# EAGLE design bms3 (EAGLE 5.04)

## Sheet 1 of 2
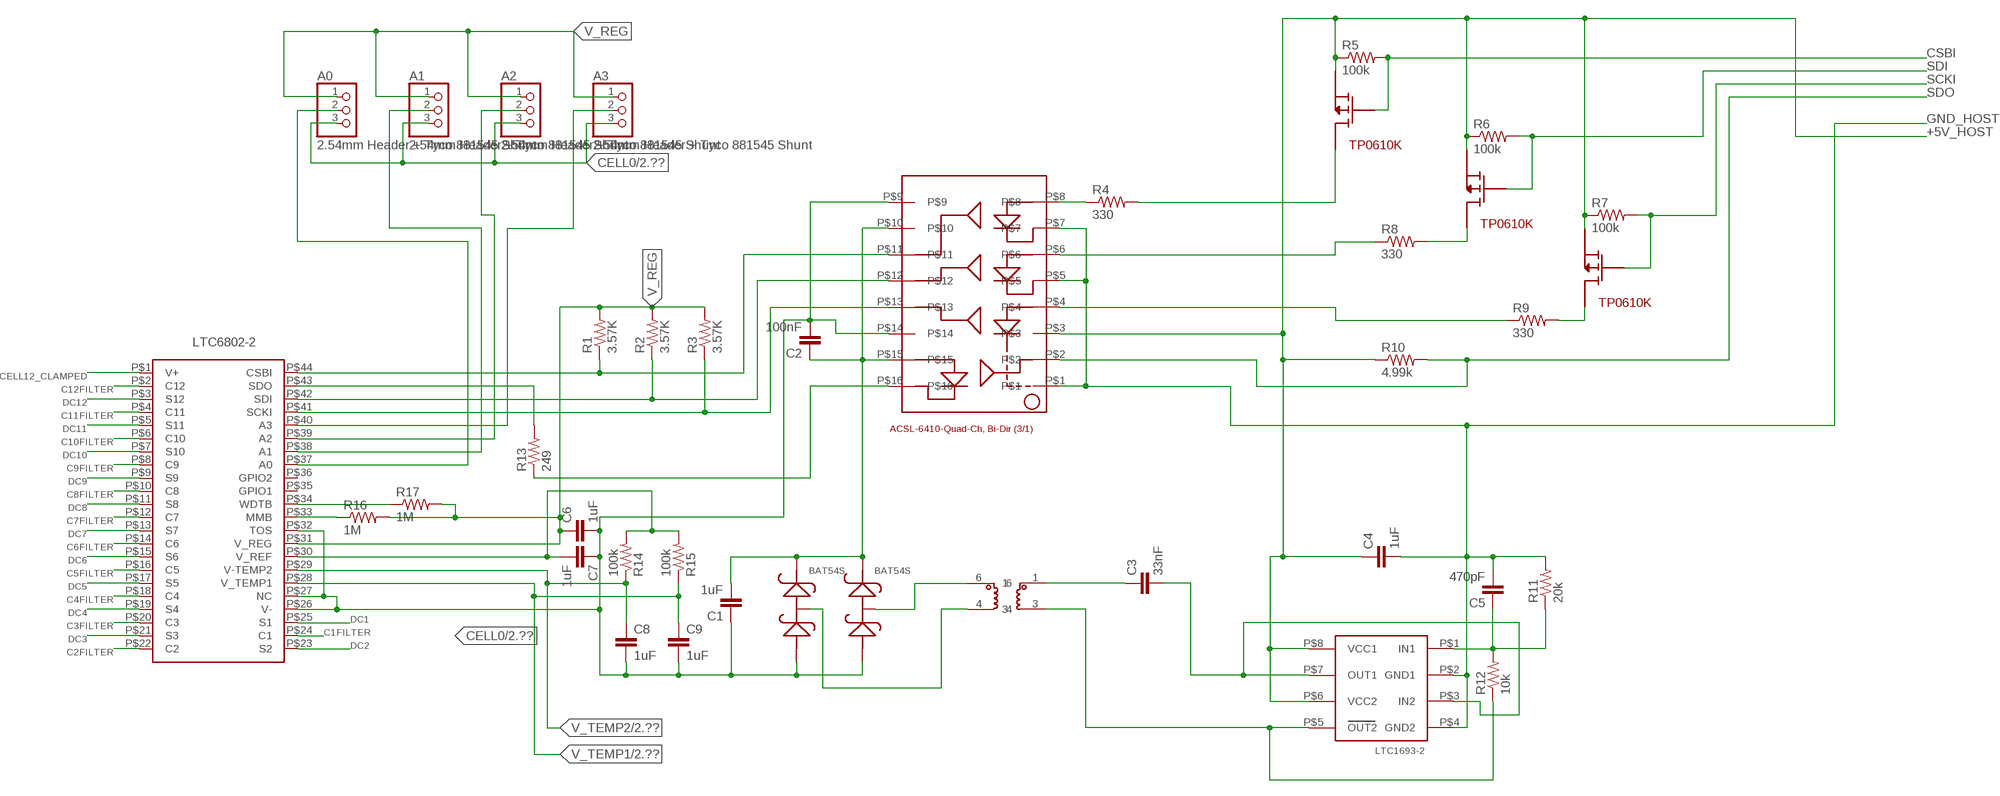
[diagram p0: schematic, sheet 1]

### Parts
A0  2.54mm Header + Tyco 881545 Shunt  PINHD-1X3  [1X03]
A1  2.54mm Header + Tyco 881545 Shunt  PINHD-1X3  [1X03]
A2  2.54mm Header + Tyco 881545 Shunt  PINHD-1X3  [1X03]
A3  2.54mm Header + Tyco 881545 Shunt  PINHD-1X3  [1X03]
ACSL6410  ACSL-6410  [ACSL-6410-SO16]
BAT1  BAT54S  [SOT-23]
BAT2  BAT54S  [SOT-23]
C1  1uF  C-EUC0402  [C0402]
C2  100nF  C-EUC0402  [C0402]
C3  33nF  C-EUC0402  [C0402]
C4  1uF  C-EUC0402  [C0402]
C5  470pF  C-EUC0402  [C0402]
C6  1uF  C-EUC0402  [C0402]
C7  1uF  C-EUC0402  [C0402]
C8  1uF  C-EUC0402  [C0402]
C9  1uF  C-EUC0402  [C0402]
CSBI  TP0610K  [SOT-23]
LTC1693  LTC1693-2  [S8-LTC1693-2]
LTC6802-2  LTC6802-2  [SSOP-44]
PE68386  PE68386  [PE68386]
R1  3.57K  R-US_R0402  [R0402]
R2  3.57K  R-US_R0402  [R0402]
R3  3.57K  R-US_R0402  [R0402]
R4  330  R-US_R0402  [R0402]
R5  100k  R-US_R0402  [R0402]
R6  100k  R-US_R0402  [R0402]
R7  100k  R-US_R0402  [R0402]
R8  330  R-US_R0402  [R0402]
R9  330  R-US_R0402  [R0402]
R10  4.99k  R-US_R0402  [R0402]
R11  20k  R-US_R0402  [R0402]
R12  10k  R-US_R0402  [R0402]
R13  249  R-US_R0402  [R0402]
R14  100k  R-US_R0402  [R0402]
R15  100k  R-US_R0402  [R0402]
R16  1M  R-US_R0402  [R0402]
R17  1M  R-US_R0402  [R0402]
SCKI  TP0610K  [SOT-23]
SDI  TP0610K  [SOT-23]

### Nets
+5V_HOST: ACSL6410.P$3 C4.1 CSBI.2 LTC1693.P$6(VCC2) LTC1693.P$8(VCC1) R5.1 R6.1 R7.1 R10.1 SCKI.2 SDI.2 ; also sheet 2
C1FILTER: LTC6802-2.P$24(C1) ; also sheet 2
C2FILTER: LTC6802-2.P$22(C2) ; also sheet 2
C3FILTER: LTC6802-2.P$20(C3) ; also sheet 2
C4FILTER: LTC6802-2.P$18(C4) ; also sheet 2
C5FILTER: LTC6802-2.P$16(C5) ; also sheet 2
C6FILTER: LTC6802-2.P$14(C6) ; also sheet 2
C7FILTER: LTC6802-2.P$12(C7) ; also sheet 2
C8FILTER: LTC6802-2.P$10(C8) ; also sheet 2
C9FILTER: LTC6802-2.P$8(C9) ; also sheet 2
C10FILTER: LTC6802-2.P$6(C10) ; also sheet 2
C11FILTER: LTC6802-2.P$4(C11) ; also sheet 2
C12FILTER: LTC6802-2.P$2(C12) ; also sheet 2
CELL0: A0.3 A1.3 A2.3 A3.3 ACSL6410.P$9 ACSL6410.P$14 BAT1.1 BAT2.1 C1.1 C2.2 C6.2 C7.1 C8.2 C9.2 LTC6802-2.P$26(V-) LTC6802-2.P$27(NC) LTC6802-2.P$32(TOS) ; also sheet 2
CELL12_CLAMPED: LTC6802-2.P$1(V+) ; also sheet 2
CSBI: CSBI.1 R5.2 ; also sheet 2
DC1: LTC6802-2.P$25(S1) ; also sheet 2
DC2: LTC6802-2.P$23(S2) ; also sheet 2
DC3: LTC6802-2.P$21(S3) ; also sheet 2
DC4: LTC6802-2.P$19(S4) ; also sheet 2
DC5: LTC6802-2.P$17(S5) ; also sheet 2
DC6: LTC6802-2.P$15(S6) ; also sheet 2
DC7: LTC6802-2.P$13(S7) ; also sheet 2
DC8: LTC6802-2.P$11(S8) ; also sheet 2
DC9: LTC6802-2.P$9(S9) ; also sheet 2
DC10: LTC6802-2.P$7(S10) ; also sheet 2
DC11: LTC6802-2.P$5(S11) ; also sheet 2
DC12: LTC6802-2.P$3(S12) ; also sheet 2
GND_HOST: ACSL6410.P$1 ACSL6410.P$5 ACSL6410.P$7 C4.2 C5.2 LTC1693.P$2(GND1) LTC1693.P$4(GND2) R11.2 ; also sheet 2
N$1: ACSL6410.P$11 LTC6802-2.P$44(CSBI) R1.1
N$2: A3.2 LTC6802-2.P$40(A3)
N$3: ACSL6410.P$12 LTC6802-2.P$42(SDI) R2.1
N$4: ACSL6410.P$13 LTC6802-2.P$41(SCKI) R3.1
N$5: A2.2 LTC6802-2.P$39(A2)
N$6: A1.2 LTC6802-2.P$38(A1)
N$7: ACSL6410.P$16 R13.1
N$8: LTC6802-2.P$43(SDO) R13.2
N$10: BAT2.3 PE68386.6
N$11: BAT1.3 PE68386.4
N$12: R8.2 SDI.3
N$13: C3.1 PE68386.1
N$14: LTC1693.P$5(OUT2) PE68386.3 R12.1
N$15: C3.2 LTC1693.P$3(IN2) LTC1693.P$7(OUT1)
N$16: A0.2 LTC6802-2.P$37(A0)
N$17: ACSL6410.P$6 R8.1
N$18: C5.1 LTC1693.P$1(IN1) R11.1 R12.2
N$19: R9.2 SCKI.3
N$20: ACSL6410.P$4 R9.1
N$22: LTC6802-2.P$34(WDTB) R17.1
N$24: LTC6802-2.P$33(MMB) R16.1
N$25: ACSL6410.P$8 R4.1
N$26: CSBI.3 R4.2
N$31: ACSL6410.P$10 ACSL6410.P$15 BAT1.2 BAT2.2 C1.2 C2.1
SCKI: R7.2 SCKI.1 ; also sheet 2
SDI: R6.2 SDI.1 ; also sheet 2
SDO: ACSL6410.P$2 R10.2 ; also sheet 2
V_REF: C7.2 LTC6802-2.P$30(V_REF) R14.2 R15.2
V_REG: A0.1 A1.1 A2.1 A3.1 C6.1 LTC6802-2.P$31(V_REG) R1.2 R2.2 R3.2 R16.2 R17.2
V_TEMP1: C9.1 LTC6802-2.P$28(V_TEMP1) R15.1 ; also sheet 2
V_TEMP2: C8.1 LTC6802-2.P$29(V-TEMP2) R14.1 ; also sheet 2
Unconnected: LTC6802-2.P$35(GPIO1) LTC6802-2.P$36(GPIO2)

## Sheet 2 of 2
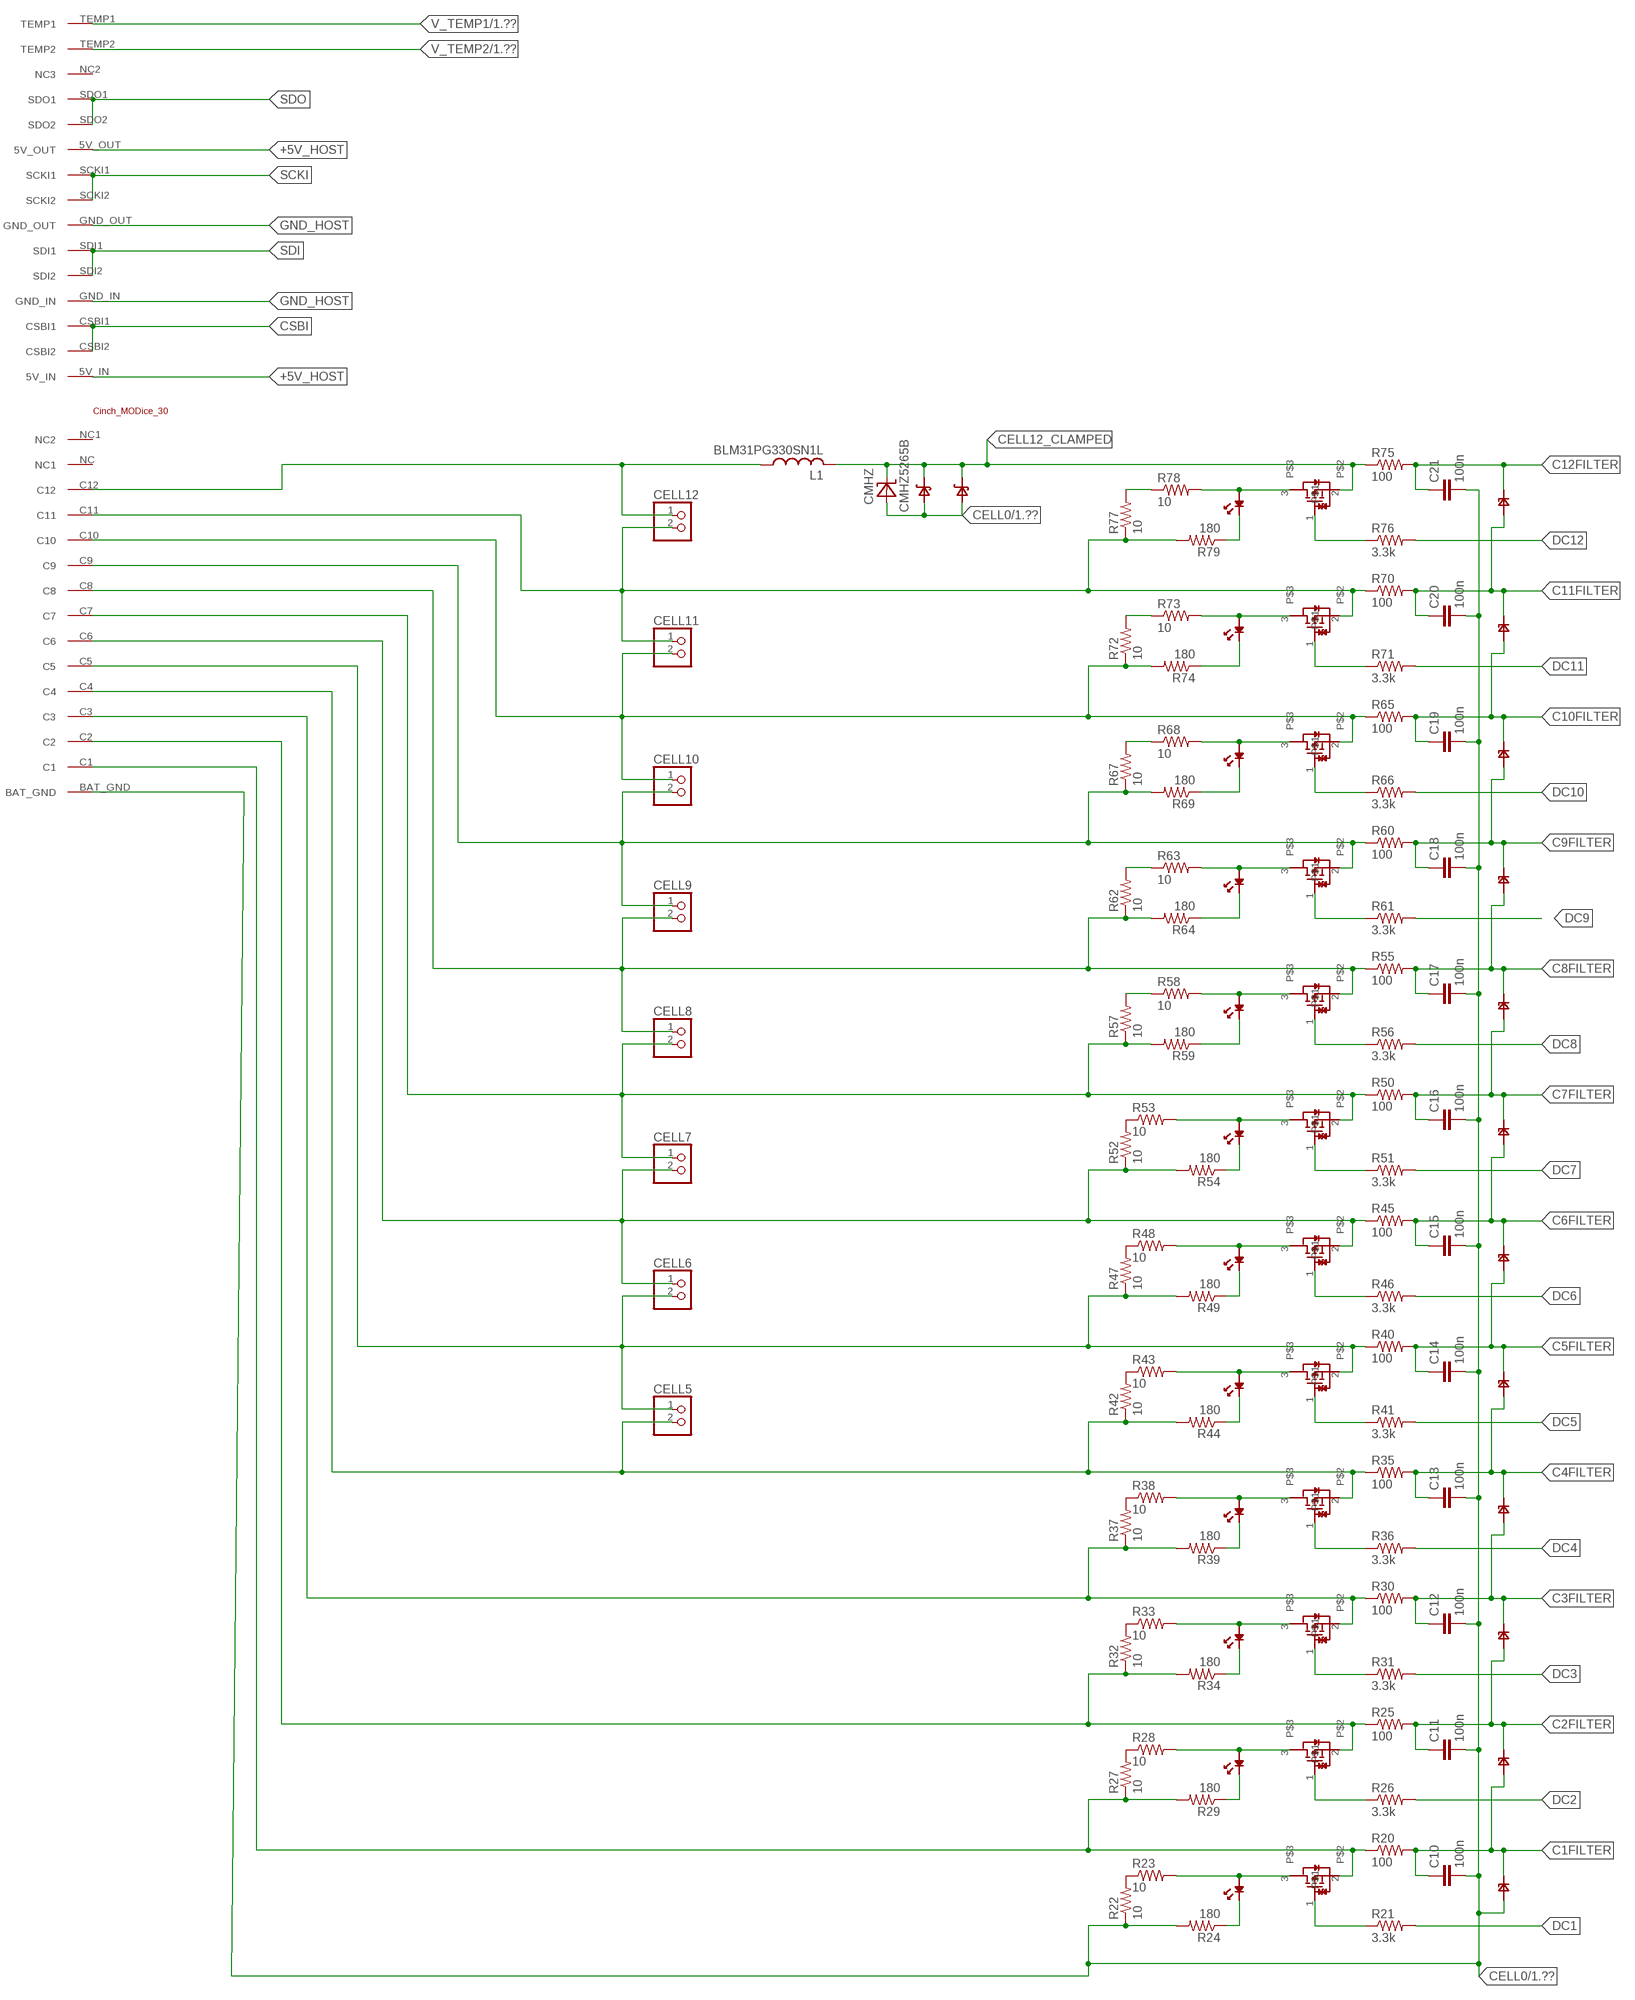
[diagram p1: schematic, sheet 2]

### Parts
BAT3  BAT46W  [SOD123]
BAT4  BAT46W  [SOD123]
C10  100n  C-EUC0402  [C0402]
C11  100n  C-EUC0402  [C0402]
C12  100n  C-EUC0402  [C0402]
C13  100n  C-EUC0402  [C0402]
C14  100n  C-EUC0402  [C0402]
C15  100n  C-EUC0402  [C0402]
C16  100n  C-EUC0402  [C0402]
C17  100n  C-EUC0402  [C0402]
C18  100n  C-EUC0402  [C0402]
C19  100n  C-EUC0402  [C0402]
C20  100n  C-EUC0402  [C0402]
C21  100n  C-EUC0402  [C0402]
CELL5  PINHD-1X2  [1X02]
CELL6  PINHD-1X2  [1X02]
CELL7  PINHD-1X2  [1X02]
CELL8  PINHD-1X2  [1X02]
CELL9  PINHD-1X2  [1X02]
CELL10  PINHD-1X2  [1X02]
CELL11  PINHD-1X2  [1X02]
CELL12  PINHD-1X2  [1X02]
CMHZ  CMHZ5265B  [SOD123]
L1  BLM31PG330SN1L  L-USL3216C  [L3216C]
LED1  LED-0805  [0805]
LED2  LED-0805  [0805]
LED3  LED-0805  [0805]
LED4  LED-0805  [0805]
LED5  LED-0805  [0805]
LED6  LED-0805  [0805]
LED7  LED-0805  [0805]
LED8  LED-0805  [0805]
LED9  LED-0805  [0805]
LED10  LED-0805  [0805]
LED11  LED-0805  [0805]
LED12  LED-0805  [0805]
MODICE  MODICE_30  [CINCH_HEADER30]
PD1  PDZ7.5B  [SOD323]
PD2  PDZ7.5B  [SOD323]
PD3  PDZ7.5B  [SOD323]
PD4  PDZ7.5B  [SOD323]
PD5  PDZ7.5B  [SOD323]
PD6  PDZ7.5B  [SOD323]
PD7  PDZ7.5B  [SOD323]
PD8  PDZ7.5B  [SOD323]
PD9  PDZ7.5B  [SOD323]
PD10  PDZ7.5B  [SOD323]
PD11  PDZ7.5B  [SOD323]
PD12  PDZ7.5B  [SOD323]
R20  100  R-US_R0402  [R0402]
R21  3.3k  R-US_R0402  [R0402]
R22  10  R-US_R2512  [R2512]
R23  10  R-US_R2512  [R2512]
R24  180  R-US_R0805  [R0805]
R25  100  R-US_R0402  [R0402]
R26  3.3k  R-US_R0402  [R0402]
R27  10  R-US_R2512  [R2512]
R28  10  R-US_R2512  [R2512]
R29  180  R-US_R0805  [R0805]
R30  100  R-US_R0402  [R0402]
R31  3.3k  R-US_R0402  [R0402]
R32  10  R-US_R2512  [R2512]
R33  10  R-US_R2512  [R2512]
R34  180  R-US_R0805  [R0805]
R35  100  R-US_R0402  [R0402]
R36  3.3k  R-US_R0402  [R0402]
R37  10  R-US_R2512  [R2512]
R38  10  R-US_R2512  [R2512]
R39  180  R-US_R0805  [R0805]
R40  100  R-US_R0402  [R0402]
R41  3.3k  R-US_R0402  [R0402]
R42  10  R-US_R2512  [R2512]
R43  10  R-US_R2512  [R2512]
R44  180  R-US_R0805  [R0805]
R45  100  R-US_R0402  [R0402]
R46  3.3k  R-US_R0402  [R0402]
R47  10  R-US_R2512  [R2512]
R48  10  R-US_R2512  [R2512]
R49  180  R-US_R0805  [R0805]
R50  100  R-US_R0402  [R0402]
R51  3.3k  R-US_R0402  [R0402]
R52  10  R-US_R2512  [R2512]
R53  10  R-US_R2512  [R2512]
R54  180  R-US_R0805  [R0805]
R55  100  R-US_R0402  [R0402]
R56  3.3k  R-US_R0402  [R0402]
R57  10  R-US_R2512  [R2512]
R58  10  R-US_R2512  [R2512]
R59  180  R-US_R0805  [R0805]
R60  100  R-US_R0402  [R0402]
R61  3.3k  R-US_R0402  [R0402]
R62  10  R-US_R2512  [R2512]
R63  10  R-US_R2512  [R2512]
R64  180  R-US_R0805  [R0805]
R65  100  R-US_R0402  [R0402]
R66  3.3k  R-US_R0402  [R0402]
R67  10  R-US_R2512  [R2512]
R68  10  R-US_R2512  [R2512]
R69  180  R-US_R0805  [R0805]
R70  100  R-US_R0402  [R0402]
R71  3.3k  R-US_R0402  [R0402]
R72  10  R-US_R2512  [R2512]
R73  10  R-US_R2512  [R2512]
R74  180  R-US_R0805  [R0805]
R75  100  R-US_R0402  [R0402]
R76  3.3k  R-US_R0402  [R0402]
R77  10  R-US_R2512  [R2512]
R78  10  R-US_R2512  [R2512]
R79  180  R-US_R0805  [R0805]
T1  RTR020P02  [TSMT3]
T2  RTR020P02  [TSMT3]
T3  RTR020P02  [TSMT3]
T4  RTR020P02  [TSMT3]
T5  RTR020P02  [TSMT3]
T6  RTR020P02  [TSMT3]
T7  RTR020P02  [TSMT3]
T8  RTR020P02  [TSMT3]
T9  RTR020P02  [TSMT3]
T10  RTR020P02  [TSMT3]
T11  RTR020P02  [TSMT3]
T12  RTR020P02  [TSMT3]

### Nets
+5V_HOST: MODICE.5V_IN MODICE.5V_OUT ; also sheet 1
C1FILTER: C10.1 PD1.P$1 PD2.P$2 R20.2 ; also sheet 1
C2FILTER: C11.1 PD2.P$1 PD3.P$2 R25.2 ; also sheet 1
C3FILTER: C12.1 PD3.P$1 PD4.P$2 R30.2 ; also sheet 1
C4FILTER: C13.1 PD4.P$1 PD5.P$2 R35.2 ; also sheet 1
C5FILTER: C14.1 PD5.P$1 PD6.P$2 R40.2 ; also sheet 1
C6FILTER: C15.1 PD6.P$1 PD7.P$2 R45.2 ; also sheet 1
C7FILTER: C16.1 PD7.P$1 PD8.P$2 R50.2 ; also sheet 1
C8FILTER: C17.1 PD8.P$1 PD9.P$2 R55.2 ; also sheet 1
C9FILTER: C18.1 PD9.P$1 PD10.P$2 R60.2 ; also sheet 1
C10FILTER: C19.1 PD10.P$1 PD11.P$2 R65.2 ; also sheet 1
C11FILTER: C20.1 PD11.P$1 PD12.P$2 R70.2 ; also sheet 1
C12FILTER: C21.1 PD12.P$1 R75.2 ; also sheet 1
CELL0: BAT3.POS BAT4.POS C10.2 C11.2 C12.2 C13.2 C14.2 C15.2 C16.2 C17.2 C18.2 C19.2 C20.2 C21.2 CMHZ.POS(A) MODICE.BAT_GND PD1.P$2 R22.1 R24.2 ; also sheet 1
CELL1: MODICE.C1 R20.1 R27.1 R29.2 T1.2
CELL2: MODICE.C2 R25.1 R32.1 R34.2 T2.2
CELL3: MODICE.C3 R30.1 R37.1 R39.2 T3.2
CELL4: CELL5.2 MODICE.C4 R35.1 R42.1 R44.2 T4.2
CELL5: CELL5.1 CELL6.2 MODICE.C5 R40.1 R47.1 R49.2 T5.2
CELL6: CELL6.1 CELL7.2 MODICE.C6 R45.1 R52.1 R54.2 T6.2
CELL7: CELL7.1 CELL8.2 MODICE.C7 R50.1 R57.1 R59.2 T7.2
CELL8: CELL8.1 CELL9.2 MODICE.C8 R55.1 R62.1 R64.2 T8.2
CELL9: CELL9.1 CELL10.2 MODICE.C9 R60.1 R67.1 R69.2 T9.2
CELL10: CELL10.1 CELL11.2 MODICE.C10 R65.1 R72.1 R74.2 T10.2
CELL11: CELL11.1 CELL12.2 MODICE.C11 R70.1 R77.1 R79.2 T11.2
CELL12: CELL12.1 L1.1 MODICE.C12
CELL12_CLAMPED: BAT3.NEG BAT4.NEG CMHZ.NEG(C) L1.2 R75.1 T12.2 ; also sheet 1
CSBI: MODICE.CSBI1 MODICE.CSBI2 ; also sheet 1
DC1: R21.2 ; also sheet 1
DC2: R26.2 ; also sheet 1
DC3: R31.2 ; also sheet 1
DC4: R36.2 ; also sheet 1
DC5: R41.2 ; also sheet 1
DC6: R46.2 ; also sheet 1
DC7: R51.2 ; also sheet 1
DC8: R56.2 ; also sheet 1
DC9: R61.2 ; also sheet 1
DC10: R66.2 ; also sheet 1
DC11: R71.2 ; also sheet 1
DC12: R76.2 ; also sheet 1
GND_HOST: MODICE.GND_IN MODICE.GND_OUT ; also sheet 1
LED3: LED3.P$1 R34.1
N$9: R77.2 R78.1
N$27: LED1.P$2 R23.2 T1.3
N$28: LED1.P$1 R24.1
N$29: LED2.P$2 R28.2 T2.3
N$30: R21.1 T1.1
N$32: R72.2 R73.1
N$33: R67.2 R68.1
N$34: LED2.P$1 R29.1
N$35: R26.1 T2.1
N$36: R62.2 R63.1
N$37: LED9.P$2 R63.2 T9.3
N$38: R57.2 R58.1
N$39: LED3.P$2 R33.2 T3.3
N$40: R52.2 R53.1
N$41: R31.1 T3.1
N$42: R47.2 R48.1
N$43: LED4.P$2 R38.2 T4.3
N$44: LED4.P$1 R39.1
N$45: R42.2 R43.1
N$46: R37.2 R38.1
N$47: LED9.P$1 R64.1
N$48: R32.2 R33.1
N$49: LED5.P$2 R43.2 T5.3
N$50: LED5.P$1 R44.1
N$51: R41.1 T5.1
N$52: R27.2 R28.1
N$53: LED6.P$2 R48.2 T6.3
N$54: LED6.P$1 R49.1
N$55: R46.1 T6.1
N$56: R22.2 R23.1
N$57: R61.1 T9.1
N$59: LED7.P$2 R53.2 T7.3
N$60: LED7.P$1 R54.1
N$61: R51.1 T7.1
N$63: LED8.P$2 R58.2 T8.3
N$64: LED8.P$1 R59.1
N$65: R56.1 T8.1
N$72: LED10.P$2 R68.2 T10.3
N$73: LED10.P$1 R69.1
N$74: R66.1 T10.1
N$77: LED11.P$2 R73.2 T11.3
N$78: LED11.P$1 R74.1
N$79: R71.1 T11.1
N$81: LED12.P$2 R78.2 T12.3
N$82: LED12.P$1 R79.1
N$83: R76.1 T12.1
SCKI: MODICE.SCKI1 MODICE.SCKI2 ; also sheet 1
SDI: MODICE.SDI1 MODICE.SDI2 ; also sheet 1
SDO: MODICE.SDO1 MODICE.SDO2 ; also sheet 1
T4: R36.1 T4.1
V_TEMP1: MODICE.TEMP1 ; also sheet 1
V_TEMP2: MODICE.TEMP2 ; also sheet 1
Unconnected: MODICE.NC1(NC2) MODICE.NC2(NC3) MODICE.NC(NC1)

## Library data of the parts
A0 A1-A3 = pinhead:PINHD-1X3: PIN HEADER
ACSL6410 = BMS:ACSL-6410
BAT1 BAT2 = BMS:BAT54S
BAT3 BAT4 = BMS:BAT46W: BAT46W Small singla Schottky Diode
C1-C21 = rcl:C-EU: CAPACITOR, European symbol
CELL5-CELL12 = pinhead:PINHD-1X2: PIN HEADER
CMHZ = BMS:CMHZ5265B
CSBI SCKI SDI = BMS:TP0610K
L1 = rcl:L-US: INDUCTOR, American symbol
LED1-LED12 = BMS:LED-0805: Green 2V 20mA SMT diode
LTC1693 = BMS:LTC1693-2
LTC6802-2 = BMS:LTC6802-2
MODICE = BMS:MODICE_30: Cinch MODice 30 enclosure header
PD1-PD12 = BMS:PDZ7.5B
PE68386 = BMS:PE68386
R1-R17 R20-R79 = rcl:R-US_: RESISTOR, American symbol
T1-T12 = BMS:RTR020P02

## Board
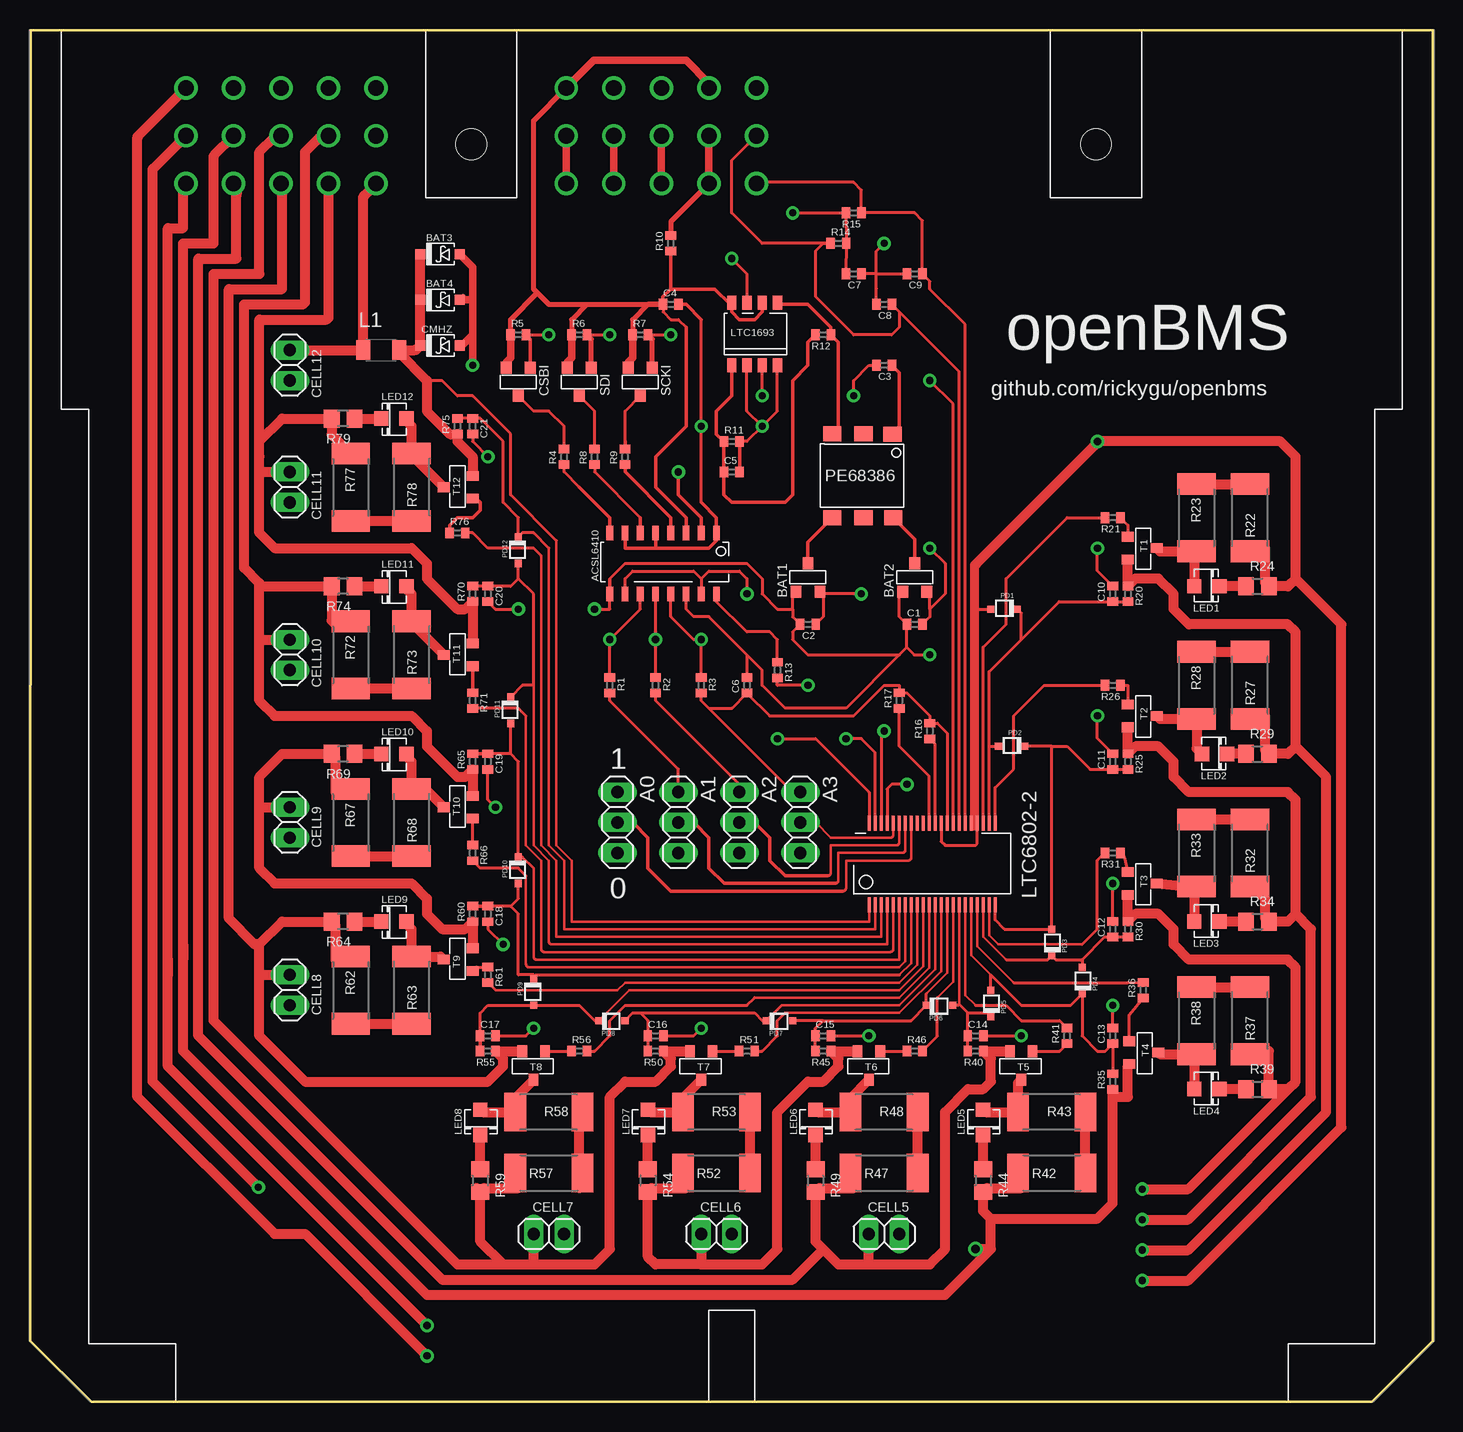
[diagram p2: board, top side]
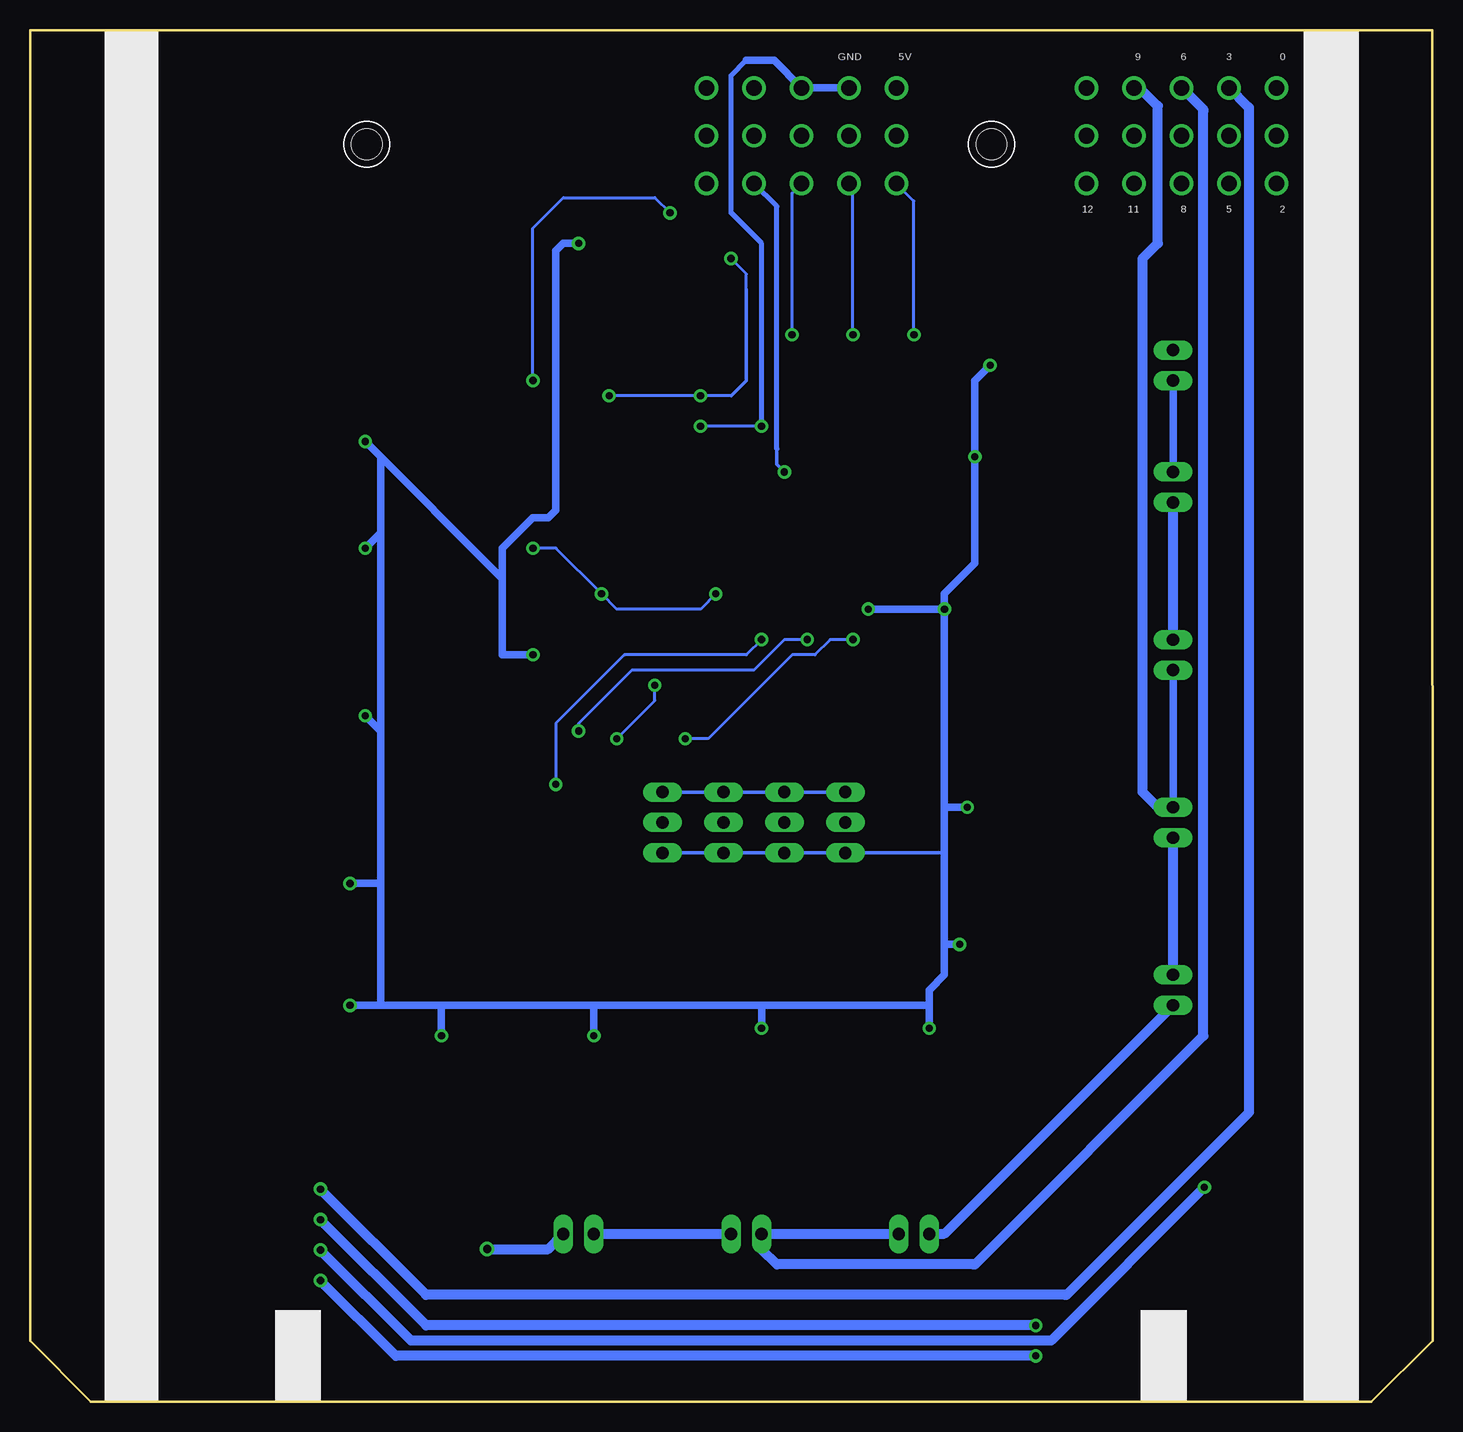
[diagram p3: board, bottom side, seen from below]

Size 116.9 x 114.3 mm. Coordinates in mm from the lower left corner, seen from the top.
Outline: 111.82,0 116.9,5.08 116.9,114.3 0.06,114.3 0,5.08 5.14,0 111.82,0
Copper layers (1*16): Top 0.035mm / dielectric 1.5mm / Bottom 0.035mm
Design rules "SparkFun": minimum track width 8mil, minimum drill 20mil, track to track 8mil, track to pad 8mil, pad to pad 8mil, via to via 8mil, smd to smd 8mil, copper to edge 10mil, drill to drill 8mil, minimum pad ring 12mil, minimum via ring 10mil, stop-mask expansion 4mil, vias tented up to drill 25mil, thermal gap 10mil

### Footprints (pad centres in the part's own frame; a part is rotated, then mirrored left to right if it is on the bottom)
1X03 = drill 1.016 long: 1 -2.54,0; 2 0,0; 3 2.54,0
ACSL-6410-SO16 = smd 0.559 x 1.194: P$1 0,0; P$2 1.27,0; P$3 2.54,0; P$4 3.81,0; P$5 5.08,0; P$6 6.35,0; P$7 7.62,0; P$8 8.89,0; P$9 8.89,5.08; P$10 7.62,5.08; P$11 6.35,5.08; P$12 5.08,5.08; P$13 3.81,5.08; P$14 2.54,5.08; P$15 1.27,5.08; P$16 0,5.08
SOT-23 = smd 0.9 x 1: 1 1,2.35; 2 -1,2.35; 3 0,0
SOD123 = smd 0.85 x 0.85: NEG 3.1,0.9; POS -0.2,0.9
C0402 = smd 0.7 x 0.9: 1 -0.65,0; 2 0.65,0
1X02 = drill 1.016 long: 1 -1.27,0; 2 1.27,0
L3216C = smd 1.2 x 1.6: 1 -1.5,0; 2 1.5,0
0805 = smd 1.2 x 1.2: P$1 0,0; P$2 2.1,0
S8-LTC1693-2 = smd 0.762 x 1.143: P$1 0,0; P$2 1.27,0; P$3 2.54,0; P$4 3.81,0; P$5 3.81,5.207; P$6 2.54,5.207; P$7 1.27,5.207; P$8 0,5.207
SSOP-44 = smd 0.25 x 1.25: P$1 -5.05,-3.04; P$2 -4.55,-3.04; P$3 -4.05,-3.04; P$4 -3.55,-3.04; P$5 -3.05,-3.04; P$6 -2.55,-3.04; P$7 -2.05,-3.04; P$8 -1.55,-3.04; P$9 -1.05,-3.04; P$10 -0.55,-3.04; P$11 -0.05,-3.04; P$12 0.45,-3.04; P$13 0.95,-3.04; P$14 1.45,-3.04; P$15 1.95,-3.04; P$16 2.45,-3.04; P$17 2.95,-3.04; P$18 3.45,-3.04; P$19 3.95,-3.04; P$20 4.45,-3.04; P$21 4.95,-3.04; P$22 5.45,-3.04; P$23 5.45,3.76; P$24 4.95,3.76; P$25 4.45,3.76; P$26 3.95,3.76; P$27 3.45,3.76; P$28 2.95,3.76; P$29 2.45,3.76; P$30 1.95,3.76; P$31 1.45,3.76; P$32 0.95,3.76; P$33 0.45,3.76; P$34 -0.05,3.76; P$35 -0.55,3.76; P$36 -1.05,3.76; P$37 -1.55,3.76; P$38 -2.05,3.76; P$39 -2.55,3.76; P$40 -3.05,3.76; P$41 -3.55,3.76; P$42 -4.05,3.76; P$43 -4.55,3.76; P$44 -5.05,3.76
CINCH_HEADER30 = drill 1.3 round: 5V_IN 7.92,4.704; 5V_OUT 19.8,4.704; BAT_GND -23.76,4.704; C1 -23.76,0.714; C2 -23.76,-3.276; C3 -19.8,4.704; C4 -19.8,0.714; C5 -19.8,-3.276; C6 -15.84,4.704; C7 -15.84,0.714; C8 -15.84,-3.276; C9 -11.88,4.704; C10 -11.88,0.714; C11 -11.88,-3.276; C12 -7.92,-3.276; CSBI1 7.92,-3.276; CSBI2 7.92,0.714; GND_IN 11.88,4.704; GND_OUT 15.84,4.704; NC -7.92,0.714; NC1 -7.92,4.704; NC2 23.76,4.704; SCKI1 15.84,-3.276; SCKI2 15.84,0.714; SDI1 11.88,-3.276; SDI2 11.88,0.714; SDO1 19.8,-3.276; SDO2 19.8,0.714; TEMP1 23.76,-3.276; TEMP2 23.76,0.714 | hole 2.54: 0,0.003; 52.07,0.003
SOD323 = smd 0.6 x 0.6: P$1 -2.2,0; P$2 0,0
PE68386 = smd 1.27 x 1.524: 1 -0.61,5.766; 2 -0.635,3.353; 3 -0.635,0.762; 4 6.35,0.762; 5 6.35,3.353; 6 6.35,5.842
R0402 = smd 0.7 x 0.9: 1 -0.65,0; 2 0.65,0
R2512 = smd 1.8 x 3.2: 1 -2.8,0; 2 2.8,0
R0805 = smd 1.3 x 1.5: 1 -0.95,0; 2 0.95,0
TSMT3 = smd 0.8 x 1: 1 -0.95,0; 2 0.95,0; 3 0,2.4

### Placement (x,y rotation side)
A0  48.95,48.26 270 top
A1  54.03,48.26 270 top
A2  59.11,48.26 270 top
A3  64.19,48.26 270 top
ACSL6410  57.21,72.39 180 top
BAT1  64.83,69.85 180 top
BAT2  73.72,69.85 180 top
BAT3  35.62,96.52 180 top
BAT4  35.62,92.71 180 top
C1  73.72,64.77 0 top
C2  64.83,64.77 180 top
C3  71.18,86.36 180 top
C4  53.4,91.44 0 top
C5  58.48,77.47 0 top
C6  59.75,59.69 90 top
C7  68.64,93.98 180 top
C8  71.18,91.44 180 top
C9  73.72,93.98 180 top
C10  90.23,67.31 90 top
C11  90.23,53.34 90 top
C12  90.23,39.37 90 top
C13  90.23,30.48 90 top
C14  78.8,30.48 0 top
C15  66.1,30.48 0 top
C16  52.13,30.48 0 top
C17  38.16,30.48 0 top
C18  38.16,40.64 270 top
C19  38.16,53.34 270 top
C20  38.16,67.31 270 top
C21  36.89,81.28 270 top
CELL5  71.18,13.97 0 top
CELL6  57.21,13.97 0 top
CELL7  43.24,13.97 0 top
CELL8  21.65,34.29 270 top
CELL9  21.65,48.26 270 top
CELL10  21.65,62.23 270 top
CELL11  21.65,76.2 270 top
CELL12  21.65,86.36 270 top
CMHZ  35.62,88.9 180 top
CSBI  40.7,83.82 0 top
L1  29.27,87.63 0 top
LED1  99.12,67.94 180 top
LED2  99.75,53.98 180 top
LED3  99.12,40.01 180 top
LED4  99.12,26.04 180 top
LED5  79.43,22.23 90 top
LED6  65.46,22.23 90 top
LED7  51.49,22.23 90 top
LED8  37.52,22.23 90 top
LED9  29.27,40.01 0 top
LED10  29.27,53.98 0 top
LED11  29.27,67.94 0 top
LED12  29.27,81.92 0 top
LTC1693  58.48,86.36 0 top
LTC6802-2  74.99,44.45 0 top
MODICE  36.77,104.78 0 top
PD1  80.07,66.04 180 top
PD2  80.7,54.61 180 top
PD3  85.15,39.37 90 top
PD4  87.69,36.2 90 top
PD5  80.07,34.29 90 top
PD6  76.89,33.02 0 top
PD7  63.56,31.75 0 top
PD8  49.59,31.75 0 top
PD9  41.97,33.02 270 top
PD10  40.7,43.18 270 top
PD11  40.06,56.52 270 top
PD12  40.7,69.85 270 top
PE68386  66.1,80.01 270 top
R1  48.32,59.69 270 top
R2  52.13,59.69 270 top
R3  55.94,59.69 270 top
R4  44.51,78.74 90 top
R5  40.7,88.9 0 top
R6  45.78,88.9 0 top
R7  50.86,88.9 0 top
R8  47.05,78.74 90 top
R9  49.59,78.74 90 top
R10  53.4,96.52 90 top
R11  58.48,80.01 0 top
R12  66.1,88.9 180 top
R13  62.29,60.96 270 top
R14  67.37,96.52 0 top
R15  68.64,99.06 180 top
R16  74.99,55.88 90 top
R17  72.45,58.42 90 top
R20  91.5,67.31 270 top
R21  90.23,73.66 180 top
R22  101.66,73.66 90 top
R23  97.21,73.66 270 top
R24  102.29,67.94 0 top
R25  91.5,53.34 270 top
R26  90.23,59.69 180 top
R27  101.66,59.69 90 top
R28  97.21,59.69 270 top
R29  102.29,53.98 0 top
R30  91.5,39.37 270 top
R31  90.23,45.72 180 top
R32  101.66,45.72 90 top
R33  97.21,45.72 270 top
R34  102.29,40.01 0 top
R35  90.23,26.67 90 top
R36  92.77,34.29 90 top
R37  101.66,31.75 90 top
R38  97.21,31.75 270 top
R39  102.29,26.04 0 top
R40  78.8,29.21 180 top
R41  86.42,30.48 90 top
R42  85.15,19.05 0 top
R43  85.15,24.13 180 top
R44  79.43,18.41 270 top
R45  66.1,29.21 180 top
R46  73.72,29.21 0 top
R47  71.18,19.05 0 top
R48  71.18,24.13 180 top
R49  65.46,18.41 270 top
R50  52.13,29.21 180 top
R51  59.75,29.21 0 top
R52  57.21,19.05 0 top
R53  57.21,24.13 180 top
R54  51.49,18.41 270 top
R55  38.16,29.21 180 top
R56  45.78,29.21 0 top
R57  43.24,19.05 0 top
R58  43.24,24.13 180 top
R59  37.52,18.41 270 top
R60  36.89,40.64 90 top
R61  38.16,35.56 270 top
R62  26.73,34.29 270 top
R63  31.81,34.29 90 top
R64  26.09,40.01 180 top
R65  36.89,53.34 90 top
R66  36.89,45.72 270 top
R67  26.73,48.26 270 top
R68  31.81,48.26 90 top
R69  26.09,53.98 180 top
R70  36.89,67.31 90 top
R71  36.89,58.42 270 top
R72  26.73,62.23 270 top
R73  31.81,62.23 90 top
R74  26.09,67.94 180 top
R75  35.62,81.28 90 top
R76  35.62,72.39 0 top
R77  26.73,76.2 270 top
R78  31.81,76.2 90 top
R79  26.09,81.92 180 top
SCKI  50.86,83.82 0 top
SDI  45.78,83.82 0 top
T1  91.5,71.12 270 top
T2  91.5,57.15 270 top
T3  91.5,43.18 270 top
T4  91.62,29.08 270 top
T5  82.61,29.21 180 top
T6  69.91,29.21 180 top
T7  55.94,29.21 180 top
T8  41.97,29.21 180 top
T9  36.89,36.83 90 top
T10  36.89,49.53 90 top
T11  36.89,62.23 90 top
T12  36.89,76.2 90 top

### Tracks (layer width: path | path; a pad name or v marks a point on that pad's centre or on a via)
+5V_HOST
  Top 0.254: 54.67,89.52 54.67,89.53 54.03,90.17 53.4,90.17 52.76,90.81 52.76,91.42 C4.1
  Top 0.305: 53.4,92.71 57.08,92.71 58.35,91.44 LTC1693.P$8 58.48,90.81 59.11,90.17 60.38,90.17 61.02,90.81 LTC1693.P$6 | 53.4,92.71 52.75,92.06 C4.1 | 53.4,92.71 R10.1 | ACSL6410.P$3 54.67,73.66 52.13,76.2 52.13,78.74 54.67,81.28 54.67,89.52
  Top 0.406: 46.41,91.44 C4.1 51.49,91.44 50.22,90.17 50.22,88.92 R7.1 | R5.1 40.06,88.92 40.06,90.17 42.28,92.39 | R6.1 45.13,90.16 46.41,91.44 | 46.41,91.44 43.24,91.44 42.28,92.39 | 42.28,92.39 41.97,92.71 41.97,106.76 MODICE.5V_IN
  Top 0.61: 44.69,109.4 MODICE.5V_IN 46.97,111.76 54.67,111.76 56.57,109.86 MODICE.5V_OUT 56.95,109.48 | R6.1 45.14,88.89 45.14,87 44.78,86.63 SDI.2 | R7.1 50.22,88.89 50.22,87 49.86,86.63 SCKI.2 | CSBI.2 39.7,86.63 40.06,87 40.06,88.89 R5.1
C1FILTER
  Top 0.254: LTC6802-2.P$24 79.94,54.61 | 79.94,54.61 79.94,60.83 82.61,63.5 | 82.61,63.5 82.61,65.7 PD1.P$1 | 79.94,54.61 PD2.P$2 | 82.61,63.5 85.77,66.66 C10.1 R20.2
C2FILTER
  Top 0.254: R25.2 C11.1 88.34,52.69 86.42,54.61 85.15,54.61 | LTC6802-2.P$22 80.44,40.14 81.21,39.37 PD3.P$2 85.15,54.61 | 85.15,54.61 PD2.P$1
C3FILTER
  Top 0.203: 81.34,36.83 79.44,38.73 LTC6802-2.P$20
  Top 0.254: 81.34,36.83 84.81,36.83 PD3.P$1 85.49,36.83 87.69,36.83 | 87.69,36.83 PD4.P$2 | 87.69,36.83 89.58,38.72 C12.1 R30.2
C4FILTER
  Top 0.203: 80.07,35.56 78.44,37.19 LTC6802-2.P$18
  Top 0.254: R35.2 C13.1 89.61,29.21 88.96,29.21 87.69,30.48 PD4.P$1 86.71,33.02 82.61,33.02 80.07,35.56 PD5.P$2
C5FILTER
  Top 0.203: 77.44,33.11 LTC6802-2.P$16
  Top 0.254: PD5.P$1 79.77,32.38 78.16,32.38 | 78.16,32.38 77.44,33.11 77.35,33.02 PD6.P$2 | R40.2 C14.1 78.15,32.37 78.16,32.38
C6FILTER
  Top 0.203: 74.69,33.99 76.44,35.74 LTC6802-2.P$14
  Top 0.254: 74.69,33.99 PD6.P$1 73.42,31.75 66.1,31.75 | 66.1,31.75 65.45,31.1 C15.1 R45.2 | 66.1,31.75 PD7.P$2
C7FILTER
  Top 0.203: LTC6802-2.P$12 75.44,36.01 72.45,33.02 62.63,33.02
  Top 0.254: 62.63,33.02 PD7.P$1 61.02,31.75 60.38,32.38 50.86,32.38 | R50.2 C16.1 51.48,31.77 50.86,32.38 | 50.86,32.38 50.22,32.38 PD8.P$2
C8FILTER
  Top 0.203: PD8.P$1 49.93,34.29 72.45,34.29 74.44,36.28 LTC6802-2.P$10
  Top 0.254: PD8.P$1 47.05,31.75 45.78,33.02 PD9.P$2 38.16,33.02 37.51,32.37 C17.1
  Top 0.305: R55.2 C17.1
C9FILTER
  Top 0.203: 72.45,35.56 73.44,36.55 LTC6802-2.P$8
  Top 0.254: 40.06,41.27 40.7,40.64 40.7,35.56 41.97,35.56 PD9.P$1 41.97,35.31 arc-90 42.22,35.56 72.45,35.56 | 40.06,41.27 38.17,41.27 C18.1 | PD10.P$2 40.7,41.91 40.06,41.27
  Top 0.305: C18.1 R60.2
C10FILTER
  Top 0.203: LTC6802-2.P$6 72.44,36.83 42.22,36.83 arc-90 41.97,37.08 41.97,44.45
  Top 0.254: 41.97,44.45 41.04,45.38 PD10.P$1 40.7,53.34 40.05,53.99 | 40.05,53.99 C19.1 | 40.05,53.99 arc45 40.06,54.03 PD11.P$2
  Top 0.305: C19.1 R65.2
C11FILTER
  Top 0.203: LTC6802-2.P$4 71.44,38.1 43.49,38.1 arc-90 43.24,38.35 43.24,45.09 41.97,46.35 41.97,59.69
  Top 0.254: 40.7,68.58 PD12.P$2 | 40.7,68.58 41.97,67.31 41.97,59.69 41.04,59.69 PD11.P$1 | 40.7,68.58 40.06,67.94 arc45 40.03,67.96 C20.1 R70.2
C12FILTER
  Top 0.203: 43.24,71.12 43.24,46.35 44.51,45.09 44.51,39.37 70.44,39.37 LTC6802-2.P$2
  Top 0.254: R75.2 C21.1 37.51,81.93 39.43,80.01 39.43,74.93 40.7,73.66 PD12.P$1 41.04,72.39 41.97,72.39 43.24,71.12
CELL0  (via drill 0.6)
  Top 0.254: BAT2.1 72.64,67.5 72.45,67.31 72.45,65.39 C1.1 73.07,62.85 | 63.56,66.04 63.56,65.39 C2.2 63.56,64.15 63.56,63.5 64.83,62.23 72.45,62.23 | 63.56,66.04 63.56,67.31 63.75,67.5 BAT1.1 | 48.32,68.58 ACSL6410.P$9 | 59.75,62.23 56.57,65.41 55.3,65.41 54.67,66.04 ACSL6410.P$14 | 59.75,62.23 C6.2 | 59.75,62.23 61.02,60.96 61.02,59.69 62.92,57.78 68,57.78 72.45,62.23 | 72.45,62.23 73.07,62.85 | 73.07,62.85 73.69,62.23 v74.99,62.23 | 48.32,68.58 49.59,69.85 59.75,69.85 61.02,68.58 61.02,67.31 62.29,66.04 63.56,66.04 | 48.32,68.58 48.32,66.04 v47.05,66.04 | LTC6802-2.P$26 LTC6802-2.P$27 | 70.53,92.74 C8.2 70.53,93.98 | 70.53,93.98 70.53,95.87 v71.18,96.52 | LTC6802-2.P$26 78.94,66.04 | 78.94,66.04 PD1.P$2 | LTC6802-2.P$32 75.94,46.67 76.26,46.35 78.8,46.35 78.94,46.49 LTC6802-2.P$26 | v40.7,66.04 38.78,66.04 C20.2 | C21.2 36.89,80.01 v38.16,78.74 | C19.2 38.16,50.16 v38.79,49.53 | C18.2 38.16,39.37 v39.43,38.1 | C17.2 41.33,30.48 v41.97,31.11 | C16.2 55.3,30.48 v55.94,31.11 | C15.2 v69.91,30.48 | C14.2 v82.61,30.48 | C13.2 v90.23,33.02 | C12.2 v90.23,43.18 | C11.2 88.96,55.26 v88.96,57.15 | C10.2 88.96,69.23 v88.96,71.12 | 78.94,66.04 78.94,69.89 | 70.53,93.98 C7.1 | 70.53,93.98 C9.2
  Top 0.406: CMHZ.POS 35.99,88 | BAT4.POS 36.08,92.08
  Top 0.61: BAT3.POS 36.81,94.62 arc-45 36.89,94.44 | 36.89,90.17 36.89,88.9 36.06,88.07 arc-45 35.88,88 CMHZ.POS | 36.89,90.17 36.89,94.44 | 36.89,94.44 36.89,92.06 arc-90 36.63,91.81 BAT4.POS | 36.89,90.17 v36.89,86.36
  Top 0.813: R22.1 102.67,70.86 102.93,71.12 102.93,68.26 R24.2 104.83,67.94 105.47,68.58 | 105.47,68.58 105.47,78.74 104.2,80.01 v88.96,80.01 88.96,79.91 78.94,69.89 | MODICE.BAT_GND 9.02,105.49 arc45 8.95,105.31 8.95,25.4 20.38,13.97 22.92,13.97 v33.08,3.81 | 105.47,68.58 109.28,64.77 109.28,22.86 96.5,10.09 v92.69,10.09
  Bottom 0.254: v88.96,80.01 87.69,78.74
  Bottom 0.305: 40.7,45.72 A0.3 A1.3 A2.3 A3.3
  Bottom 0.61: v71.18,96.52 72.45,96.52 73.08,95.89 73.08,74.3 73.72,73.66 74.99,73.66 77.53,71.12 77.53,68.58 | 77.53,68.58 77.53,62.23 v74.99,62.23 | v40.7,66.04 v47.05,66.04 | v40.7,66.04 40.7,67.31 38.16,69.85 v38.16,78.74 38.16,84.98 arc45 38.08,85.16 v36.89,86.36 | 40.7,49.53 v38.79,49.53 | 40.7,49.53 v40.7,66.04 | 40.7,38.1 v39.43,38.1 | 40.7,38.1 40.7,45.72 40.7,49.53 | 40.7,38.1 40.7,35.56 41.97,34.29 41.97,33.02 | 41.97,33.02 v41.97,31.11 | 55.94,33.02 v55.94,31.11 | 55.94,33.02 41.97,33.02 | 69.91,33.02 v69.91,30.48 | 69.91,33.02 55.94,33.02 | 82.61,33.02 v82.61,30.48 | 82.61,33.02 69.91,33.02 | 87.69,33.02 82.61,33.02 | 87.69,33.02 v90.23,33.02 | 87.69,43.18 v90.23,43.18 | 87.69,43.18 87.69,33.02 | 87.69,55.88 v88.96,57.15 | 87.69,55.88 87.69,43.18 | 87.69,72.39 87.69,55.88 | 87.69,78.74 87.69,72.39 | 87.69,72.39 v88.96,71.12 | v88.96,80.01 77.53,68.58
  Bottom 0.813: v92.69,10.09 86.42,3.81 v33.08,3.81
CELL1  (via drill 0.6)
  Top 0.813: T1.2 R20.1 92.12,68.58 94.04,68.58 95.31,67.31 95.31,66.04 96.58,64.77 104.83,64.77 105.47,64.14 105.47,54.61 | 105.47,54.61 104.83,53.98 R29.2 102.93,54.29 102.93,57.15 102.67,56.89 R27.1 | MODICE.C1 10.29,102.77 arc45 10.22,102.59 10.22,26.67 v19.03,17.85 | 105.47,54.61 108.01,52.07 108.01,24.13 96.5,12.63 v92.69,12.63
  Bottom 0.813: v92.69,12.63 85.15,5.08 31.81,5.08 v19.03,17.85
CELL2  (via drill 0.6)
  Top 0.813: T2.2 R25.1 92.12,54.61 94.04,54.61 95.31,53.34 95.31,52.07 96.58,50.8 104.83,50.8 105.47,50.16 105.47,40.64 | 105.47,40.64 104.83,40.01 R34.2 102.93,40.32 102.93,41.91 101.92,42.92 R32.1 | MODICE.C2 12.83,101.32 arc45 12.76,101.14 12.76,97.79 11.49,97.79 11.49,36.83 | 11.49,36.83 11.49,35.56 | 105.47,40.64 106.74,39.37 106.74,25.4 96.5,15.17 v92.69,15.17 | v33.08,6.35 11.49,27.94 11.49,36.83
  Bottom 0.813: v33.08,6.35 83.88,6.35 v92.69,15.17
CELL3  (via drill 0.6)
  Top 0.813: T3.2 R30.1 92.12,40.64 94.04,40.64 95.31,39.37 95.31,38.1 96.58,36.83 104.83,36.83 105.47,36.2 105.47,26.67 | 105.47,26.67 104.83,26.04 R39.2 103.24,29.21 102.93,29.21 102.93,28.95 R37.1 | v92.69,17.71 96.5,17.71 105.47,26.67
  Bottom 0.813: MODICE.C3 15.37,107.88 arc45 15.3,107.7 15.3,24.13 30.46,8.96 arc45 30.64,8.89 83.88,8.89 v92.69,17.71
CELL4  (via drill 0.7)
  Top 0.305: 79.43,15.88 79.99,15.31 arc-45 80.07,15.13 80.07,13.97
  Top 0.813: T4.2 91.5,28.01 91.5,25.4 90.23,25.4 R35.1 90.23,16.51 88.96,15.24 80.07,15.24 | 80.07,15.24 79.43,15.88 R44.2 79.75,17.78 82.61,17.78 82.35,18.04 R42.1 | MODICE.C4 15.37,103.89 arc45 15.3,103.71 15.3,96.52 12.76,96.52 12.76,38.1 | 12.76,38.1 12.76,36.83 | 80.07,12.7 80.07,15.24 | 80.07,12.7 v78.8,12.7 | 12.76,38.1 12.76,29.21 33.08,8.89 76.26,8.89 80.07,12.7
  Bottom 0.813: v78.8,12.7 73.72,12.7 CELL5.2
CELL5
  Top 0.813: T5.2 R40.1 80.07,28.59 80.07,26.67 79.43,26.04 78.16,26.04 76.26,24.13 76.26,12.7 74.99,11.43 69.91,11.43 | 69.91,11.43 67.37,11.43 66.1,12.7 | 66.1,12.7 65.46,13.34 R49.2 65.78,17.78 68.64,17.78 68.38,18.04 R47.1 | 69.91,11.43 CELL5.1 | MODICE.C5 17.13,101.34 arc-45 17.2,100.53 17.2,95.25 14.03,95.25 14.03,30.48 34.35,10.16 63.56,10.16 66.1,12.7
  Bottom 0.813: CELL5.1 CELL6.2
CELL6
  Top 0.813: T6.2 R45.1 67.37,28.59 67.37,27.94 66.1,26.67 64.83,26.67 62.29,24.13 62.29,12.7 61.02,11.43 55.94,11.43 | 55.94,11.43 52.13,11.43 51.49,12.06 R54.2 51.81,17.78 54.67,17.78 54.41,18.04 R52.1 | CELL6.1 55.94,11.43
  Bottom 0.813: CELL7.2 CELL6.1 55.94,12.8 arc-45 55.86,12.63 54.67,11.43 38.26,11.43 arc-45 38.08,11.5 19.11,30.48 19.11,107.55 arc-45 19.18,107.73 MODICE.C6
CELL7
  Top 0.813: T7.2 R50.1 53.4,28.59 53.4,27.94 52.13,26.67 49.59,26.67 48.32,25.4 48.32,12.7 47.05,11.43 41.97,11.43 | 39.43,11.43 41.97,11.43 | 39.43,11.43 37.52,13.34 R59.2 | R59.2 37.84,17.78 40.7,17.78 40.44,18.04 R57.1 | R59.2 37.21,17.78 | 41.97,11.43 CELL7.1 | MODICE.C7 20.56,105.49 arc45 20.38,105.42 19.11,104.14 19.11,93.98 15.3,93.98 15.3,31.75 35.62,11.43 39.43,11.43
  Bottom 0.305: 40.8,13.97 arc-45 40.62,14.04
  Bottom 0.813: 40.62,14.04 CELL8.2 | CELL7.1 40.8,13.97
CELL8
  Top 0.813: T8.2 R55.1 39.43,28.59 39.43,27.94 38.16,26.67 22.92,26.67 19.11,30.48 19.11,35.56 | R62.1 25.72,37.09 25.46,36.83 25.46,39.69 R64.2 21.01,40.01 19.11,38.1 | 19.11,35.56 19.11,38.1 | 19.11,35.56 CELL8.1 | MODICE.C8 21.09,101.02 arc45 21.01,100.84 21.01,92.71 16.57,92.71 16.57,40.26 18.65,38.17 arc45 18.83,38.1 19.11,38.1
  Bottom 0.813: CELL8.1 CELL9.2
CELL9
  Top 0.813: T9.2 R60.1 36.27,39.37 34.35,39.37 33.08,40.64 33.08,41.91 31.81,43.18 20.38,43.18 19.11,44.45 19.11,49.53 | 19.11,49.53 19.11,52.07 21.01,53.98 R69.2 25.46,53.66 25.46,50.8 25.72,51.06 R67.1 | 19.11,49.53 CELL9.1
  Bottom 0.61: CELL9.1 CELL10.2
  Bottom 0.813: MODICE.C9 24.55,109.48 arc45 24.37,109.41 22.92,107.95 22.92,96.52 24.11,95.32 arc-45 24.19,95.14 24.19,50.8 22.99,49.6 arc-45 22.81,49.53 CELL9.1
CELL10
  Top 0.813: T10.2 R65.1 36.27,52.07 35.62,52.07 33.08,54.61 33.08,55.88 31.81,57.15 20.38,57.15 19.11,58.42 19.11,63.5 | 19.11,63.5 19.11,67.94 | 19.11,67.94 R74.2 25.14,65.08 25.46,64.77 26.47,64.77 R72.1 | 19.11,63.5 CELL10.1 | MODICE.C10 24.37,105.49 arc45 24.19,105.42 22.92,104.14 22.92,91.69 arc-90 22.66,91.44 17.84,91.44 17.84,69.47 19.11,68.2 19.11,67.94
  Bottom 0.813: CELL10.1 CELL11.2
CELL11
  Top 0.813: T11.2 R70.1 36.27,66.04 35.62,66.04 33.08,68.58 33.08,69.85 31.81,71.12 20.38,71.12 19.11,72.39 19.11,77.47 | 19.11,77.47 19.11,78.74 | 19.11,78.74 19.11,80.01 21.01,81.92 R79.2 25.14,80.58 R77.1 | 19.11,77.47 CELL11.1 | 19.11,78.74 19.11,90.17 24.64,90.17 arc90 24.89,90.42 MODICE.C11
  Bottom 0.61: CELL11.1 CELL12.2
CELL12
  Top 0.813: CELL12.1 L1.1 27.77,100.31 arc-45 27.84,100.49 MODICE.C12
CELL12_CLAMPED
  Top 0.203: LTC6802-2.P$1 69.94,40.01 45.14,40.01 45.14,45.09 43.87,46.35 43.87,71.75
  Top 0.254: 43.87,71.75 40.06,75.56 40.06,80.64 36.89,83.82 35.62,83.82 34.35,85.09 33.08,85.09
  Top 0.813: BAT3.NEG BAT4.NEG CMHZ.NEG 32.22,87.7 arc-45 32.04,87.63 L1.2 30.77,87.4 33.08,85.09 33.08,82.55 35,80.63 R75.1 35.62,80.01 36.89,78.74 T12.2
CSBI  (via drill 0.6)
  Top 0.254: R5.2 v43.24,88.9
  Top 0.305: R5.2 41.7,88.55 CSBI.1
  Top 0.61: MODICE.CSBI1 MODICE.CSBI2
  Bottom 0.254: v43.24,88.9 43.24,100.05 MODICE.CSBI1
DC1
  Top 0.254: LTC6802-2.P$25 79.44,62.87 81.34,64.77 81.34,68.58 86.42,73.66 R21.2
DC2
  Top 0.254: LTC6802-2.P$23 80.44,51.17 81.97,52.7 81.97,57.15 84.51,59.69 R26.2
DC3
  Top 0.203: 87.69,38.1 80.7,38.1 79.94,38.87 LTC6802-2.P$21
  Top 0.254: R31.2 88.96,45.1 88.96,39.37 87.69,38.1
DC4
  Top 0.203: 81.97,34.92 78.94,37.96 LTC6802-2.P$19
  Top 0.254: R36.2 91.48,34.92 81.97,34.92
DC5
  Top 0.203: 78.8,33.02 77.94,33.88 LTC6802-2.P$17
  Top 0.254: R41.2 85.8,31.75 82.61,31.75 81.34,33.02 78.8,33.02
DC6
  Top 0.203: 75.62,33.66 76.94,34.97 LTC6802-2.P$15
  Top 0.254: R46.2 75.62,30.46 75.62,33.66
DC7
  Top 0.203: LTC6802-2.P$13 75.94,35.88 72.45,32.38 62.92,32.38
  Top 0.254: R51.2 61.02,29.21 62.29,30.48 62.29,31.75 62.92,32.38
DC8
  Top 0.203: 60.38,33.66 72.45,33.66 74.94,36.15 LTC6802-2.P$11
  Top 0.254: R56.2 47.05,29.21 48.32,30.48 48.32,31.75 49.59,33.02 59.75,33.02 60.38,33.66
DC9
  Top 0.203: 38.81,34.29 48.95,34.29 49.59,34.92 72.45,34.92 73.94,36.41 LTC6802-2.P$9
  Top 0.254: R61.2 38.81,34.29
DC10
  Top 0.203: 41.33,43.81 41.33,37.47 41.33,36.45 arc90 41.59,36.2 42.6,36.2 72.45,36.2 72.94,36.69 LTC6802-2.P$7
  Top 0.254: 41.33,43.81 40.7,44.45 37.51,44.45 R66.2
DC11
  Top 0.203: LTC6802-2.P$5 71.94,38.1 71.94,37.72 arc-90 71.68,37.47 42.86,37.47 arc-90 42.6,37.72 42.6,45.09 41.33,46.35 41.33,57.15
  Top 0.254: 41.33,57.15 40.79,57.7 arc45 40.61,57.77 R71.2
DC12
  Top 0.203: LTC6802-2.P$3 70.94,38.73 43.87,38.73 43.87,45.09 42.6,46.35 42.6,70.48
  Top 0.254: R76.2 36.89,72.39 38.16,71.12 41.97,71.12 42.6,70.48
GND_HOST  (via drill 0.6)
  Top 0.254: LTC1693.P$2 59.75,82.55 v61.02,81.28 | 55.94,90.17 v55.94,81.28 55.94,74.93 | v61.02,81.28 62.29,82.55 LTC1693.P$4 | v61.02,81.28 59.75,80.01 R11.2
  Top 0.305: R11.2 C5.2 | 55.94,74.93 57.21,73.66 ACSL6410.P$1 57.21,71.75 56.57,71.12 52.13,71.12 | C4.2 54.67,91.44 55.94,90.17 | 52.13,71.12 ACSL6410.P$5 | 52.13,71.12 49.59,71.12 ACSL6410.P$7
  Bottom 0.254: v55.94,81.28 v61.02,81.28
  Bottom 0.406: 57.21,111.76 58.48,110.49 58.48,99.06 55.94,96.52 v55.94,81.28
  Bottom 0.61: MODICE.GND_IN MODICE.GND_OUT 54.89,111.76 57.21,111.76
LED3
  Top 0.813: R34.1 LED3.P$1
N$1  (via drill 0.6)
  Top 0.254: ACSL6410.P$11 50.86,66.04 v48.32,63.5 R1.1 | v62.29,55.24 65.46,55.24 69.94,50.77 LTC6802-2.P$44
  Bottom 0.254: v48.32,63.5 50.22,63.5 51.49,62.23 53.4,62.23 60.38,55.24 v62.29,55.24
N$2
  Top 0.203: 65.46,48.26 66.73,46.99 71.68,46.99 arc90 71.94,47.24 LTC6802-2.P$40
  Top 0.305: A3.2 65.46,48.26
N$3  (via drill 0.6)
  Top 0.254: ACSL6410.P$12 v52.13,63.5 R2.1 | v71.18,55.88 70.94,55.64 LTC6802-2.P$42
  Bottom 0.254: v52.13,63.5 54.03,63.5 56.57,60.96 66.73,60.96 71.18,56.52 v71.18,55.88
N$4  (via drill 0.6)
  Top 0.254: ACSL6410.P$13 53.4,65.41 55.3,63.5 v55.94,63.5 R3.1 | v73.08,51.44 71.81,51.44 71.44,51.06 LTC6802-2.P$41
  Bottom 0.254: v55.94,63.5 57.21,62.23 67.37,62.23 73.08,56.52 v73.08,51.44
N$5
  Top 0.203: 66.48,43.81 arc90 66.73,44.07 66.73,46.35 72.18,46.35 arc90 72.44,46.61 LTC6802-2.P$39
  Top 0.305: A2.2 60.28,48.26 arc-45 60.46,48.19 61.65,46.99 61.65,45.09 62.92,43.81 66.48,43.81
N$6
  Top 0.203: 67.11,43.18 arc90 67.37,43.43 67.37,45.72 72.68,45.72 arc90 72.94,45.97 LTC6802-2.P$38
  Top 0.305: A1.2 55.2,48.26 arc-45 55.38,48.19 56.57,46.99 56.57,44.45 57.84,43.18 67.11,43.18
N$7
  Top 0.254: ACSL6410.P$16 57.21,66.67 59.75,64.14 61.65,64.14 62.29,63.5 R13.1
N$8  (via drill 0.6)
  Top 0.254: LTC6802-2.P$43 70.44,54.08 69.27,55.24 v68,55.24 | R13.2 62.29,59.69 v64.83,59.69
  Bottom 0.254: v68,55.24 64.83,58.42 v64.83,59.69
N$9
  Top 0.813: R77.2 R78.1
N$10
  Top 0.305: PE68386.6 73.72,71.88 BAT2.3
N$11
  Top 0.305: PE68386.4 64.83,71.63 BAT1.3
N$12
  Top 0.254: SDI.3 47.05,82.55 R8.2
N$13
  Top 0.305: PE68386.1 71.86,80.7 72.45,81.28 72.45,85.72 71.83,86.34 C3.1
N$14
  Top 0.305: LTC1693.P$5 62.41,91.44 64.83,91.44 66.75,89.52 R12.1 67.37,88.28 67.37,81.28 66.86,80.77 PE68386.3
N$15  (via drill 0.6)
  Top 0.254: LTC1693.P$7 59.75,93.98 v58.48,95.25 | v61.02,83.82 LTC1693.P$3 | C3.2 69.91,86.36 68.64,85.09 v68.64,83.82
  Bottom 0.254: v58.48,95.25 57.21,93.98 57.21,92.71 | 58.48,83.82 v61.02,83.82 v68.64,83.82
  Bottom 0.305: 57.21,92.71 57.21,85.09 58.48,83.82
N$16
  Top 0.203: 67.75,42.55 arc90 68,42.8 68,45.09 73.18,45.09 arc90 73.44,45.34 LTC6802-2.P$37
  Top 0.305: A0.2 50.12,48.26 arc-45 50.3,48.19 51.49,46.99 51.49,44.45 53.4,42.55 67.75,42.55
N$17
  Top 0.254: 50.86,73.66 47.05,77.47 R8.1
  Top 0.305: 50.86,73.66 ACSL6410.P$6
N$18
  Top 0.305: LTC1693.P$1 58.48,83.82 57.21,82.55 57.21,80.63 R11.1 C5.1 57.83,75.58 58.48,74.93 62.92,74.93 63.56,75.56 63.56,85.09 64.83,86.36 64.83,88.28 R12.2
N$19
  Top 0.254: SCKI.3 49.59,82.55 49.59,80.01
  Top 0.305: R9.2 49.59,80.01
N$20
  Top 0.305: ACSL6410.P$4 53.4,73.66 49.59,77.47 R9.1
N$21
  Top 0.813: 78.75,69.67 78.77,69.68 78.77,69.7 78.83,69.76 78.83,69.8
N$22
  Top 0.254: R17.1 72.45,54.61 74.94,52.12 LTC6802-2.P$34
N$24
  Top 0.254: R16.1 75.44,54.78 LTC6802-2.P$33
N$25
  Top 0.254: 45.78,76.2 44.51,77.47 R4.1
  Top 0.305: ACSL6410.P$8 48.32,73.66 45.78,76.2
N$26
  Top 0.254: CSBI.3 41.97,82.55 43.24,82.55 44.51,81.28 R4.2
N$27
  Top 0.813: T1.3 94.16,70.86 R23.2 97.02,70.67 LED1.P$2
N$28
  Top 0.813: R24.1 LED1.P$1
N$29
  Top 0.813: T2.3 94.16,56.89 R28.2 97.21,54.41 LED2.P$2
N$30
  Top 0.254: R21.1 91.5,73.04 T1.1
N$31  (via drill 0.6)
  Top 0.254: C1.2 74.99,65.39 74.99,66.04 | 74.99,66.04 74.99,67.31 74.8,67.5 BAT2.2 | C2.1 66.1,65.39 66.1,67.31 | 66.02,67.31 BAT1.2 65.91,67.5 66.1,67.31 | 74.99,66.04 76.26,67.31 76.26,69.85 v74.99,71.12 | ACSL6410.P$10 49.59,68.58 50.22,69.22 55.3,69.22 55.94,68.58 | 55.94,68.58 ACSL6410.P$15 | 55.94,68.58 56.57,69.22 59.11,69.22 59.75,68.58 v59.75,67.31 | v69.27,67.31 66.1,67.31
  Bottom 0.254: v59.75,67.31 61.02,66.04 68,66.04 v69.27,67.31 73.08,71.12 v74.99,71.12
N$32
  Top 0.813: R72.2 R73.1
N$33
  Top 0.813: R67.2 R68.1
N$34
  Top 0.813: R29.1 LED2.P$1
N$35
  Top 0.254: T2.1 91.5,59.69 R26.1
N$36
  Top 0.813: R62.2 R63.1
N$37
  Top 0.813: T9.3 34.23,37.09 R63.2 31.81,39.37 31.37,39.81 LED9.P$2
N$38
  Top 0.813: R58.1 45.78,23.87 45.78,17.78 46.04,18.04 R57.2
N$39
  Top 0.813: T3.3 96.7,42.92 R33.2 97.02,42.48 LED3.P$2
N$40
  Top 0.813: R52.2 R53.1
N$41
  Top 0.254: R31.1 91.2,45.4 T3.1
N$42
  Top 0.813: R47.2 R48.1
N$43
  Top 0.813: LED4.P$2 97.02,28.75 R38.2 94.16,28.95 T4.3
N$44
  Top 0.813: R39.1 LED4.P$1
N$45
  Top 0.813: R42.2 R43.1
N$46
  Top 0.813: R38.1 R37.2
N$47
  Top 0.813: R64.1 LED9.P$1
N$48
  Top 0.813: R33.1 R32.2
N$49
  Top 0.813: LED5.P$2 79.63,24.13 R43.2 | R43.2 82.61,24.13 | T5.3 82.35,26.55 R43.2
N$50
  Top 0.813: R44.1 LED5.P$1
N$51
  Top 0.254: R41.1 85.8,29.21 T5.1
N$52
  Top 0.813: R28.1 R27.2
N$53
  Top 0.813: T6.3 68.38,25.28 R48.2 65.66,24.13 LED6.P$2
N$54
  Top 0.813: R49.1 LED6.P$1
N$55
  Top 0.254: T6.1 R46.1
N$56
  Top 0.813: R23.1 R22.2
N$57
  Top 0.254: R61.1 37.22,36.21 T9.1
N$59
  Top 0.813: LED7.P$2 51.69,24.13 R53.2 54.41,25.28 T7.3
N$60
  Top 0.813: R54.1 LED7.P$1
N$61
  Top 0.254: T7.1 R51.1
N$63
  Top 0.813: LED8.P$2 37.72,24.13 R58.2 40.44,25.28 T8.3
N$64
  Top 0.813: R59.1 LED8.P$1
N$65
  Top 0.254: T8.1 R56.1
N$72
  Top 0.813: LED10.P$2 31.37,53.78 31.81,53.34 R68.2 31.81,50.8 33.22,50.8 T10.3
N$73
  Top 0.813: R69.1 LED10.P$1
N$74
  Top 0.254: R66.1 T10.1
N$77
  Top 0.813: LED11.P$2 31.37,67.75 31.81,67.31 R73.2 31.81,64.91 T11.3
N$78
  Top 0.813: R74.1 LED11.P$1
N$79
  Top 0.305: R71.1 T11.1
N$81
  Top 0.813: LED12.P$2 31.37,81.72 31.81,81.28 R78.2 31.81,78.88 T12.3
N$82
  Top 0.813: R79.1 LED12.P$1
N$83
  Top 0.305: R76.1 34.97,73.01 35.62,73.66 36.89,73.66 37.52,74.3 37.52,74.93 37.2,75.25 T12.1
SCKI  (via drill 0.6)
  Top 0.254: R7.2 v53.4,88.9
  Top 0.406: R7.2 51.86,88.55 SCKI.1
  Top 0.61: MODICE.SCKI1 MODICE.SCKI2
  Bottom 0.254: v53.4,88.9 53.4,100.71 MODICE.SCKI1
SDI  (via drill 0.6)
  Top 0.254: R6.2 v48.32,88.9
  Top 0.406: R6.2 46.78,88.55 SDI.1
  Top 0.61: MODICE.SDI1 MODICE.SDI2
  Bottom 0.254: v48.32,88.9 48.32,101.17 MODICE.SDI1
SDO  (via drill 0.6)
  Top 0.305: ACSL6410.P$2 55.94,73.66 54.03,75.56 v54.03,77.47
  Top 0.406: R10.2 53.4,98.33 MODICE.SDO1
  Top 0.61: MODICE.SDO1 MODICE.SDO2
  Bottom 0.305: v54.03,77.47 54.67,78.11 54.67,79.38
  Bottom 0.406: 54.67,79.38 54.67,99.6 MODICE.SDO1
T4
  Top 0.254: R36.1 91.62,32.24 T4.1
V_REF  (via drill 0.6)
  Top 0.254: C7.2 R14.2 R15.2 v63.56,99.06 | LTC6802-2.P$30 76.94,83.14 v74.99,85.09
  Bottom 0.254: v74.99,85.09 74.99,97.79 72.45,100.33 64.83,100.33 v63.56,99.06
V_REG
  Top 0.254: LTC6802-2.P$31 76.44,55.7 75.61,56.53 R16.2 74.99,57.15 73.07,59.07 R17.2 | R17.2 72.42,59.04 | R1.2 48.32,58.42 54.03,52.7 A1.1 | R2.2 52.13,58.42 59.11,51.44 A2.1 | R3.2 55.94,58.42 56.56,57.8 | R17.2 72.45,59.69 71.18,59.69 68.64,57.15 61.64,57.15 C6.1 58.51,57.8 56.56,57.8 | 56.56,57.8 63.56,50.8 A3.1
  Bottom 0.305: A0.1 A1.1 A2.1 A3.1 65.46,50.8
V_TEMP1
  Top 0.254: LTC6802-2.P$28 77.94,89.76 74.99,92.71 74.99,93.36 C9.1 74.37,98.41 73.72,99.06 R15.1 69.29,100.95 68.64,101.6 60.63,101.6 MODICE.TEMP1
V_TEMP2
  Top 0.254: LTC6802-2.P$29 77.44,85.83 C8.1 72.45,90.82 72.45,89.53 71.81,88.9 68.64,88.9 65.46,92.08 65.46,95.89 66.1,96.52 R14.1 61.02,96.52 58.48,99.06 58.48,103.44 MODICE.TEMP2
(copper drawn outside any net)
  shapes: Top area x1

### Text on the board
tPlace: openBMS | github.com/rickygu/openbms | 1 | 0
bPlace: 0 | 3 | 6 | 9 | 5V | GND | 2 | 5 | 8 | 11 | 12